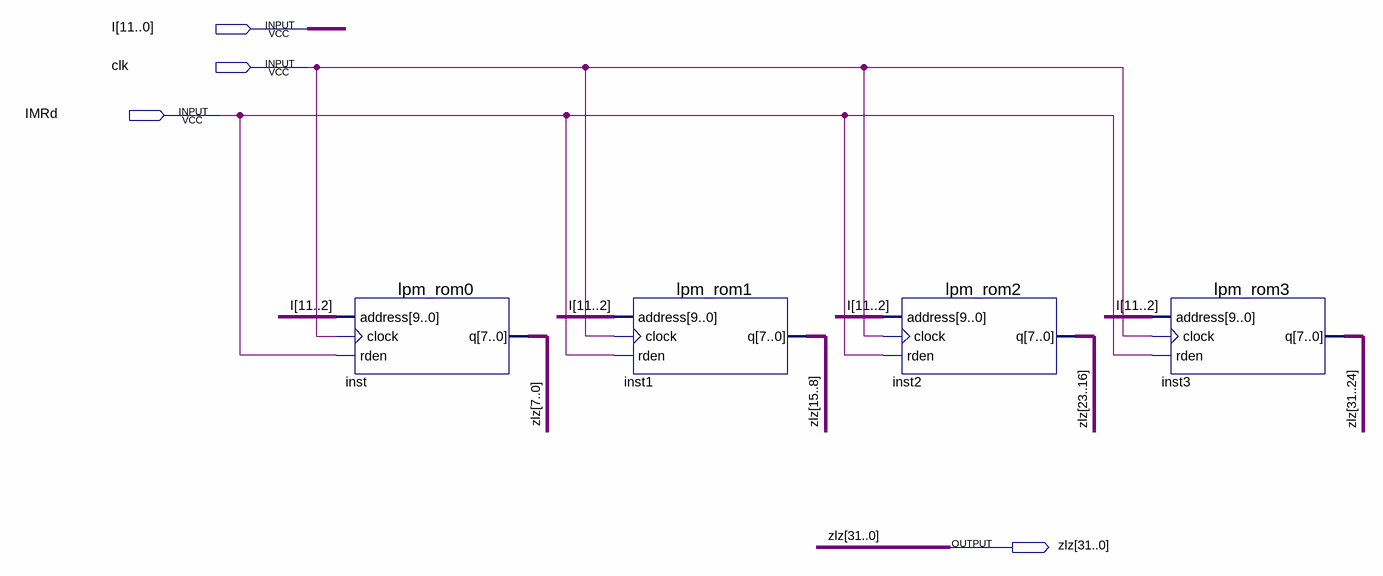
[diagram p0: schematic sheet]
// Quartus schematic IMEM.bdf as structural Verilog: 4 symbols, 4 pins
module IMEM (
  input  [11:0] I,
  input  clk,
  input  IMRd,
  output [31:0] zlz
);

  lpm_rom0 inst (.address(I[11:2]), .clock(clk), .rden(IMRd), .q(zlz[7:0]));
  lpm_rom1 inst1 (.address(I[11:2]), .clock(clk), .rden(IMRd), .q(zlz[15:8]));
  lpm_rom2 inst2 (.address(I[11:2]), .clock(clk), .rden(IMRd), .q(zlz[23:16]));
  lpm_rom3 inst3 (.address(I[11:2]), .clock(clk), .rden(IMRd), .q(zlz[31:24]));
endmodule
